# Altium schematic sheet demo_dermis_main_testboard.SchDoc
size A0
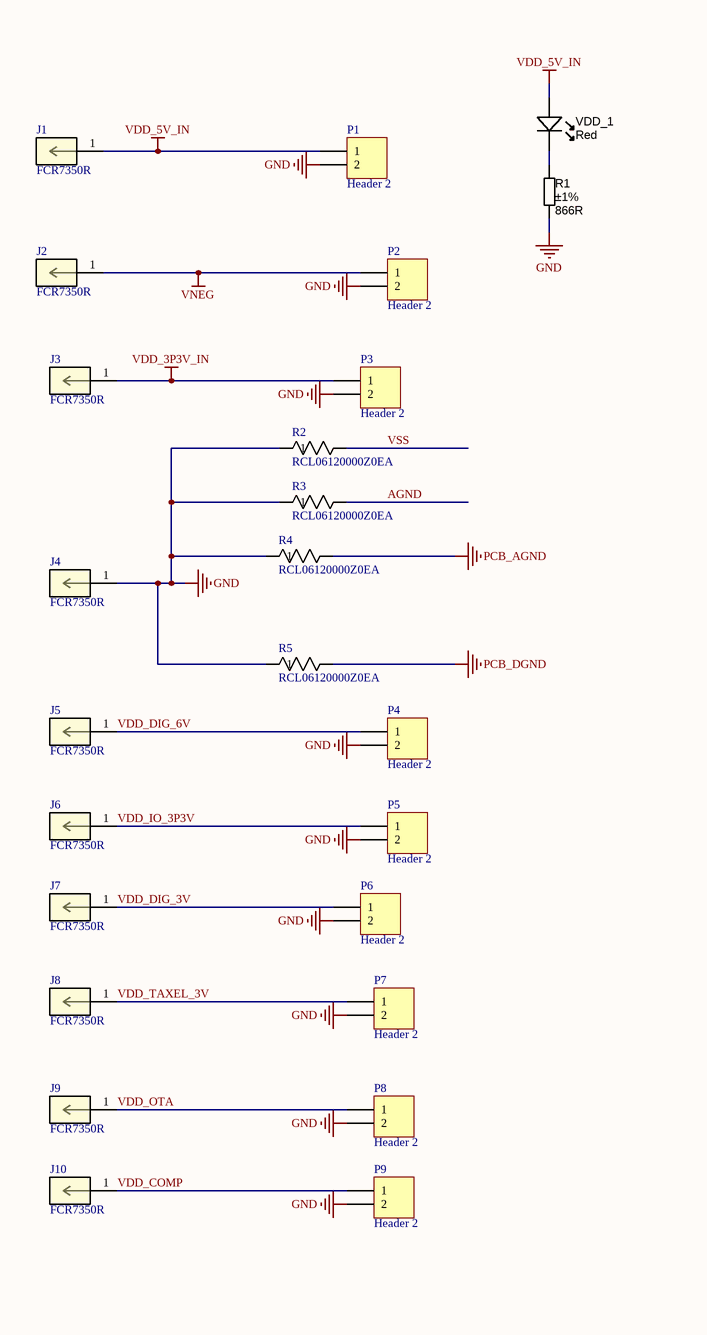
[diagram p0: demo_dermis_main_testboard.SchDoc, top left]
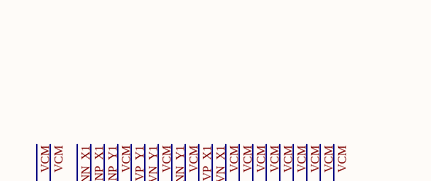
[diagram p1: demo_dermis_main_testboard.SchDoc, top right]
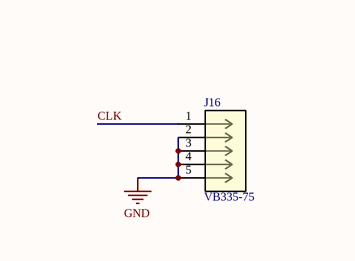
[diagram p2: demo_dermis_main_testboard.SchDoc, bottom middle]
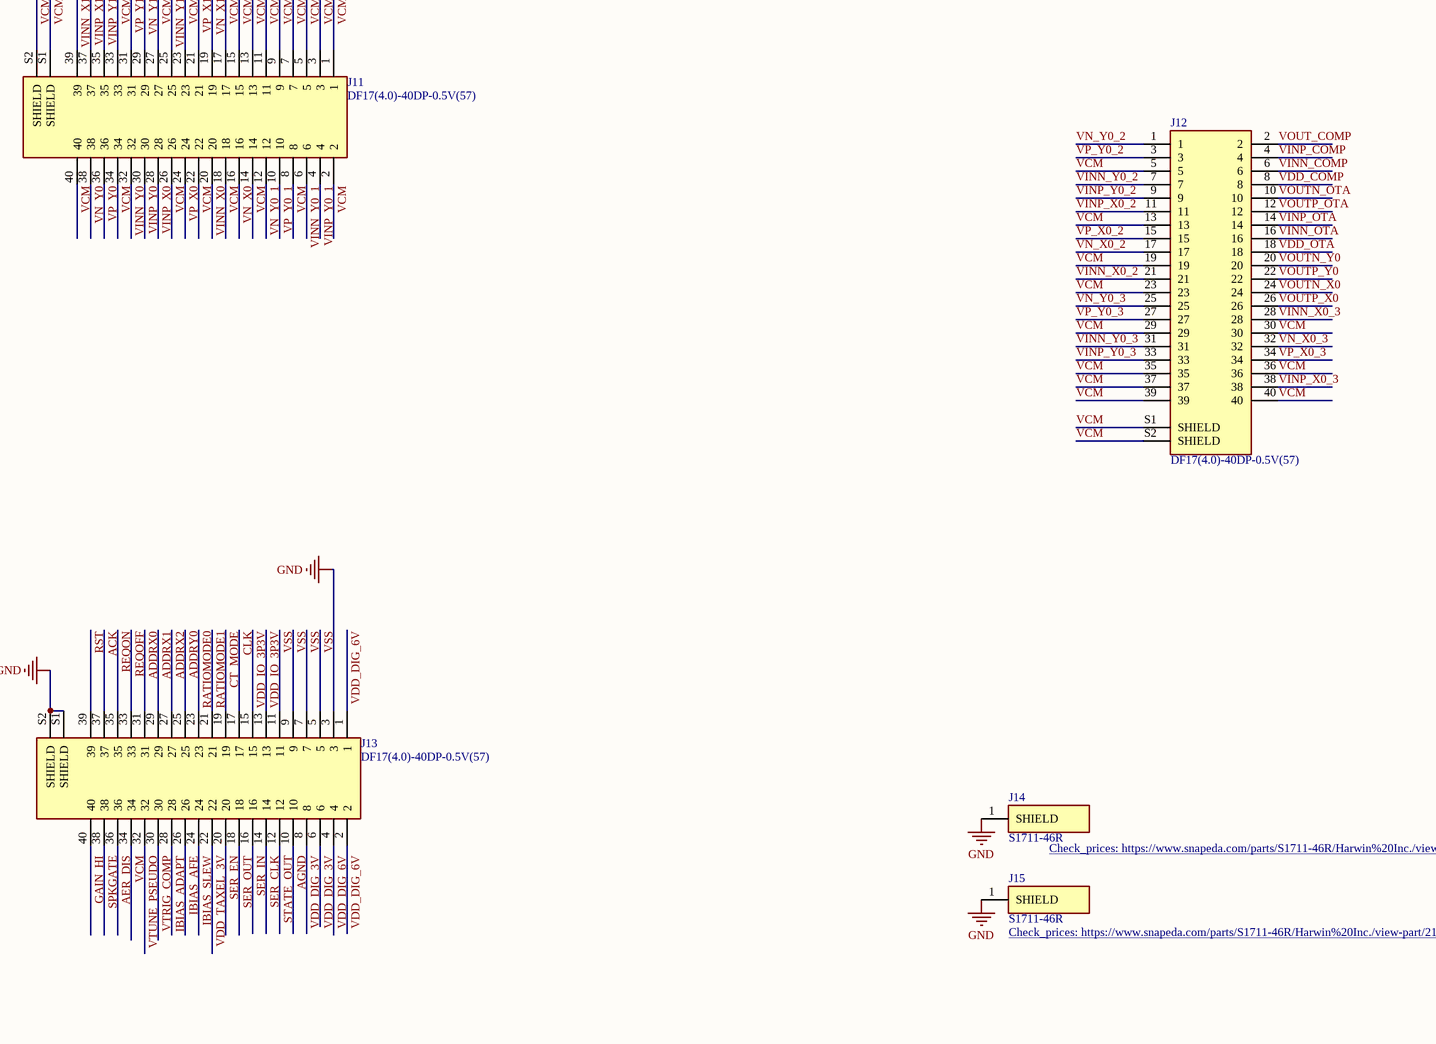
[diagram p3: demo_dermis_main_testboard.SchDoc, bottom right]

## Parts
J1  FCR7350R  [CONN1_FCR7350R_CLF]
J2  FCR7350R  [CONN1_FCR7350R_CLF]
J3  FCR7350R  [CONN1_FCR7350R_CLF]
J4  FCR7350R  [CONN1_FCR7350R_CLF]
J5  FCR7350R  [CONN1_FCR7350R_CLF]
J6  FCR7350R  [CONN1_FCR7350R_CLF]
J7  FCR7350R  [CONN1_FCR7350R_CLF]
J8  FCR7350R  [CONN1_FCR7350R_CLF]
J9  FCR7350R  [CONN1_FCR7350R_CLF]
J10  FCR7350R  [CONN1_FCR7350R_CLF]
J11  DF17(4.0)-40DP-0.5V(57)  [HRS_DF17(4.0)-40DP-0.5V(57)]
J12  DF17(4.0)-40DP-0.5V(57)  [HRS_DF17(4.0)-40DP-0.5V(57)]
J13  DF17(4.0)-40DP-0.5V(57)  [HRS_DF17(4.0)-40DP-0.5V(57)]
J14  S1711-46R  [HARWIN_S1711-46R]
J15  S1711-46R  [HARWIN_S1711-46R]
J16  VB335-75  [CONN5_VB335_CIN]
P1  Header 2  [HDR1X2]
P2  Header 2  [HDR1X2]
P3  Header 2  [HDR1X2]
P4  Header 2  [HDR1X2]
P5  Header 2  [HDR1X2]
P6  Header 2  [HDR1X2]
P7  Header 2  [HDR1X2]
P8  Header 2  [HDR1X2]
P9  Header 2  [HDR1X2]
R1  value 866R  Tolerance: ±1%  [RESC1608N]  (hidden comment: Thick Film)
R2  RCL06120000Z0EA  [RCL0612_VIS]
R3  RCL06120000Z0EA  [RCL0612_VIS]
R4  RCL06120000Z0EA  [RCL0612_VIS]
R5  RCL06120000Z0EA  [RCL0612_VIS]
VDD_1  Red  [LED-0603-RED]

## Nets
GND: J4.1 J13.3 J13.S1(SHIELD) J13.S2(SHIELD) J14.1(SHIELD) J15.1(SHIELD) J16.2 J16.3 J16.4 J16.5 P1.2 P2.2 P3.2 P4.2 P5.2 P6.2 P7.2 P8.2 P9.2 R1.2 R2.1 R3.1 R4.1 R5.1
PCB_AGND: R4.2
PCB_DGND: R5.2
VDD_3P3V_IN: J3.1 P3.1
VDD_5V_IN: J1.1 P1.1 VDD_1.A
VNEG: J2.1 P2.1
ACK: J13.37
ADDRX0: J13.31
ADDRX1: J13.29
ADDRX2: J13.27
ADDRY0: J13.25
AER_DIS: J13.36
AGND: J13.10 R3.2
CLK: J13.17 J16.1
CT_MODE: J13.19
GAIN_HI: J13.40
IBIAS_ADAPT: J13.28
IBIAS_AFE: J13.26
IBIAS_SLEW: J13.24
RATIOMODE0: J13.23
RATIOMODE1: J13.21
REQOFF: J13.33
REQON: J13.35
RST: J13.39
SER_CLK: J13.14
SER_EN: J13.20
SER_IN: J13.16
SER_OUT: J13.18
SPKGATE: J13.38
STATE_OUT: J13.12
VCM: J11.1 J11.2 J11.3 J11.5 J11.7 J11.8 J11.9 J11.11 J11.13 J11.14 J11.15 J11.17 J11.18 J11.22 J11.23 J11.26 J11.27 J11.33 J11.34 J11.40 J11.S1(SHIELD) J11.S2(SHIELD) J12.5 J12.13 J12.19 J12.23 J12.29 J12.30 J12.35 J12.36 J12.37 J12.39 J12.40 J12.S1(SHIELD) J12.S2(SHIELD) J13.34
VDD_COMP: J10.1 J12.8 P9.1
VDD_DIG_3V: J7.1 J13.6 J13.8 P6.1
VDD_DIG_6V: J5.1 J13.1 J13.2 J13.4 P4.1
VDD_IO_3P3V: J6.1 J13.13 J13.15 P5.1
VDD_OTA: J9.1 J12.18 P8.1
VDD_TAXEL_3V: J8.1 J13.22 P7.1
VINN_COMP: J12.6
VINN_OTA: J12.16
VINN_X0: J11.20
VINN_X0_2: J12.21
VINN_X0_3: J12.28
VINN_X1: J11.39
VINN_Y0: J11.32
VINN_Y0_1: J11.6
VINN_Y0_2: J12.7
VINN_Y0_3: J12.31
VINN_Y1: J11.25
VINP_COMP: J12.4
VINP_OTA: J12.14
VINP_X0: J11.28
VINP_X0_2: J12.11
VINP_X0_3: J12.38
VINP_X1: J11.37
VINP_Y0: J11.30
VINP_Y0_1: J11.4
VINP_Y0_2: J12.9
VINP_Y0_3: J12.33
VINP_Y1: J11.35
VN_X0: J11.16
VN_X0_2: J12.17
VN_X0_3: J12.32
VN_X1: J11.19
VN_Y0: J11.38
VN_Y0_1: J11.12
VN_Y0_2: J12.1
VN_Y0_3: J12.25
VN_Y1: J11.29
VOUT_COMP: J12.2
VOUTN_OTA: J12.10
VOUTN_X0: J12.24
VOUTN_Y0: J12.20
VOUTP_OTA: J12.12
VOUTP_X0: J12.26
VOUTP_Y0: J12.22
VP_X0: J11.24
VP_X0_2: J12.15
VP_X0_3: J12.34
VP_X1: J11.21
VP_Y0: J11.36
VP_Y0_1: J11.10
VP_Y0_2: J12.3
VP_Y0_3: J12.27
VP_Y1: J11.31
VSS: J13.5 J13.7 J13.9 J13.11 R2.2
VTRIG_COMP: J13.30
VTUNE_PSEUDO: J13.32
NetR1_1: R1.1 VDD_1.K

## Notes on the sheet
- Title
- Size:
- Date:
- File:
- A0
- Number:
- Time:
- Revision:
- Sheet
- of

## Library data of the parts
J1-J10 = FCR7350R: No Description Available; Mfr_Name: Cliff; Copyright: Copyright (C) 2022 Ultra Librarian. All rights reserved.; Manufacturer_Part_Number: FCR7350R; RefDes: RefDes; Type: DEV
J11-J13 = DF17(4.0)-40DP-0.5V(57): PC Board, Headers & Receptacles, hdr, fit, series, mount, pos, Connectors and Adapters, connector, header, Connectors...; Availability: Unavailable; MP: DF17(4.0)-40DP-0.5V(57); Price: None; Package: None; Value: *
J14 J15 = S1711-46R: RFI SHIELD CLIP TIN SMD; MF: Harwin Inc.; Purchase-URL: https://pricing.snapeda.com/search/part/S1711-46R/?ref=eda; MP: S1711-46R; SnapEDA_Link: https://www.snapeda.com/parts/S1711-46R/Harwin%20Inc./view-part/2172610/?ref=snap; Price: None; Package: None; Value: *; Availability: Warning; Check_prices: https://www.snapeda.com/parts/S1711-46R/Harwin%20Inc./view-part/2172610/?ref=eda
J16 = VB335-75: No Description Available; Mfr_Name: Cinch Connectivity Solutions; Type: Coaxial Connectors(RF) Assemblies; RefDes: RefDes
P1-P9 = Header 2: Header, 2-Pin; LatestRevisionDate: 17-Jul-2002; LatestRevisionNote: Re-released for DXP Platform.; Publisher: Altium Limited
R1 = RES_866R_0603_1%_1: Resistor SMD chip 866 Ohm 0.1W 1% 0603; Ratings: 1/10W; Package / Case: 0603 (1608 Metric)
R2-R5 = RCL06120000Z0EA: No Description Available; Mfr_Name: Vishay
VDD_1 = LED_SMD_Red_0603_220mcd: LED 0603 SMD Hyper Red 630nm 220mcd 20mA; Manufacturer 1: Kingbright Corp; Manufacturer Part Number 1: APT1608SURCK; Ratings: 220 mcd; 630 nm; Voltage - Forward (Vf) Typ: 1.95V; Voltage - Forward (Vf) @ 10mA: 1.9V; Package / Case: 0603 (1608 metric); Material: AlGaInP on GaAs; Supplier 1: Digi-Key; Supplier Part Number 1: 754-1123-1-ND